# EAGLE design Flame_Sword (EAGLE 9.6.2)
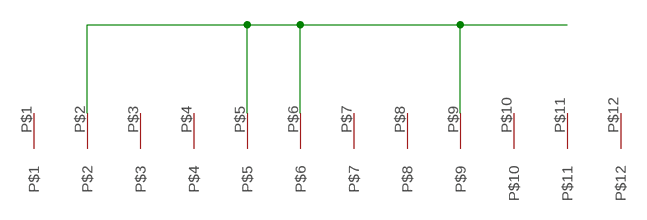
[diagram p0: schematic, sheet 1]

## Parts
U$1  BEAST  [BEAST]

## Nets
N$1: U$1.P$2 U$1.P$5 U$1.P$6 U$1.P$9
Unconnected: U$1.P$1 U$1.P$3 U$1.P$4 U$1.P$7 U$1.P$8 U$1.P$10 U$1.P$11 U$1.P$12

## Library data of the parts
U$1 = beastpins:BEAST

## Board
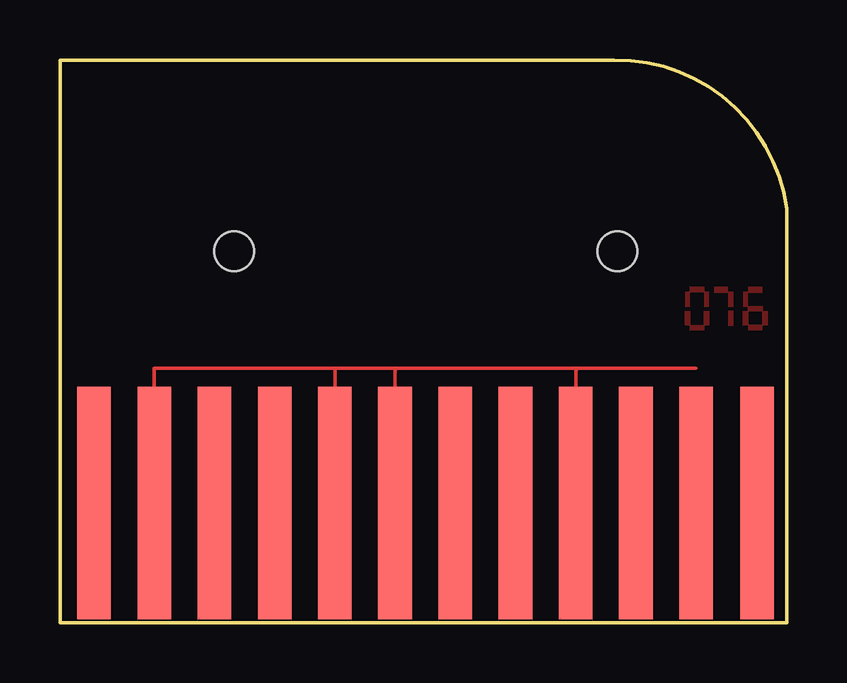
[diagram p1: board, top side]

Size 30.3 x 23.45 mm. Coordinates in mm from the lower left corner, seen from the top.
Outline: 0,0 30.3,0 30.3,17.25 arc83 23.1,23.45 0,23.45 0,0
Copper layers (1*16): Top 0.035mm / dielectric 1.5mm / Bottom 0.035mm
Design rules "default *": minimum track width 6mil, minimum drill 0.35mm, track to track 1mil, track to pad 6mil, pad to pad 6mil, via to via 6mil, smd to smd 6mil, copper to edge 0.002540625mm, drill to drill 1mil, minimum pad ring 10mil, minimum via ring 8mil, stop-mask expansion 4mil, vias tented up to drill 0mil, thermal gap 10mil
Holes 1.65 mm at 7.27,15.49 23.23,15.49

### Footprints (pad centres in the part's own frame; a part is rotated, then mirrored left to right if it is on the bottom)
BEAST = smd 1.4 x 9.7: P$1 -27.61,5.02; P$2 -25.1,5.02; P$3 -22.59,5.02; P$4 -20.08,5.02; P$5 -17.57,5.02; P$6 -15.06,5.02; P$7 -12.55,5.02; P$8 -10.04,5.02; P$9 -7.53,5.02; P$10 -5.02,5.02; P$11 -2.51,5.02; P$12 0.03,5.02

### Placement (x,y rotation side)
U$1  29.03,-0.03 0 top

### Tracks (layer width: path | path; a pad name or v marks a point on that pad's centre or on a via)
N$1
  Top 0.152: 11.49,10.6 3.93,10.6 U$1.P$2 | 11.49,10.6 14.05,10.6 | 14.05,10.6 21.58,10.6 | 21.58,10.6 26.52,10.6 | U$1.P$5 11.46,10.57 11.49,10.6 | U$1.P$6 13.97,10.52 14.05,10.6 | U$1.P$9 21.5,10.52 21.58,10.6
N$2
  pour Top: 26.86,13.78 26.86,13.19 27.06,13.19 27.06,13.78
N$3
  pour Top: 26.27,13.98 26.27,13.8 26.86,13.8 26.86,13.98
N$4
  pour Top: 26.27,12.4 26.07,12.4 26.07,12.99 26.27,12.99
N$5
  pour Top: 27.06,12.4 26.86,12.4 26.86,12.99 27.06,12.99
N$6
  pour Top: 27.28,13.98 27.28,13.78 27.85,13.78 27.85,13.98
N$7
  pour Top: 28.49,13.78 28.49,13.19 28.67,13.19 28.67,13.78
N$8
  pour Top: 29.28,12.99 28.69,12.99 28.69,13.19 29.28,13.19
N$9
  pour Top: 28.67,12.4 28.49,12.4 28.49,12.99 28.67,12.99
N$10
  pour Top: 29.48,12.4 29.3,12.4 29.3,12.99 29.48,12.99
N$11
  pour Top: 28.69,12.4 28.69,12.2 29.28,12.2 29.28,12.4
N$16
  pour Top: 26.27,12.38 26.27,12.2 26.86,12.2 26.86,12.38
N$23
  pour Top: 26.07,13.78 26.07,13.19 26.27,13.19 26.27,13.78
N$26
  pour Top: 27.87,12.99 27.87,12.4 28.07,12.4 28.07,12.99
N$30
  pour Top: 27.87,13.78 27.87,13.19 28.07,13.19 28.07,13.78
N$42
  pour Top: 28.69,13.98 28.69,13.78 29.28,13.78 29.28,13.98